# Altium project DATN.PrjPcb
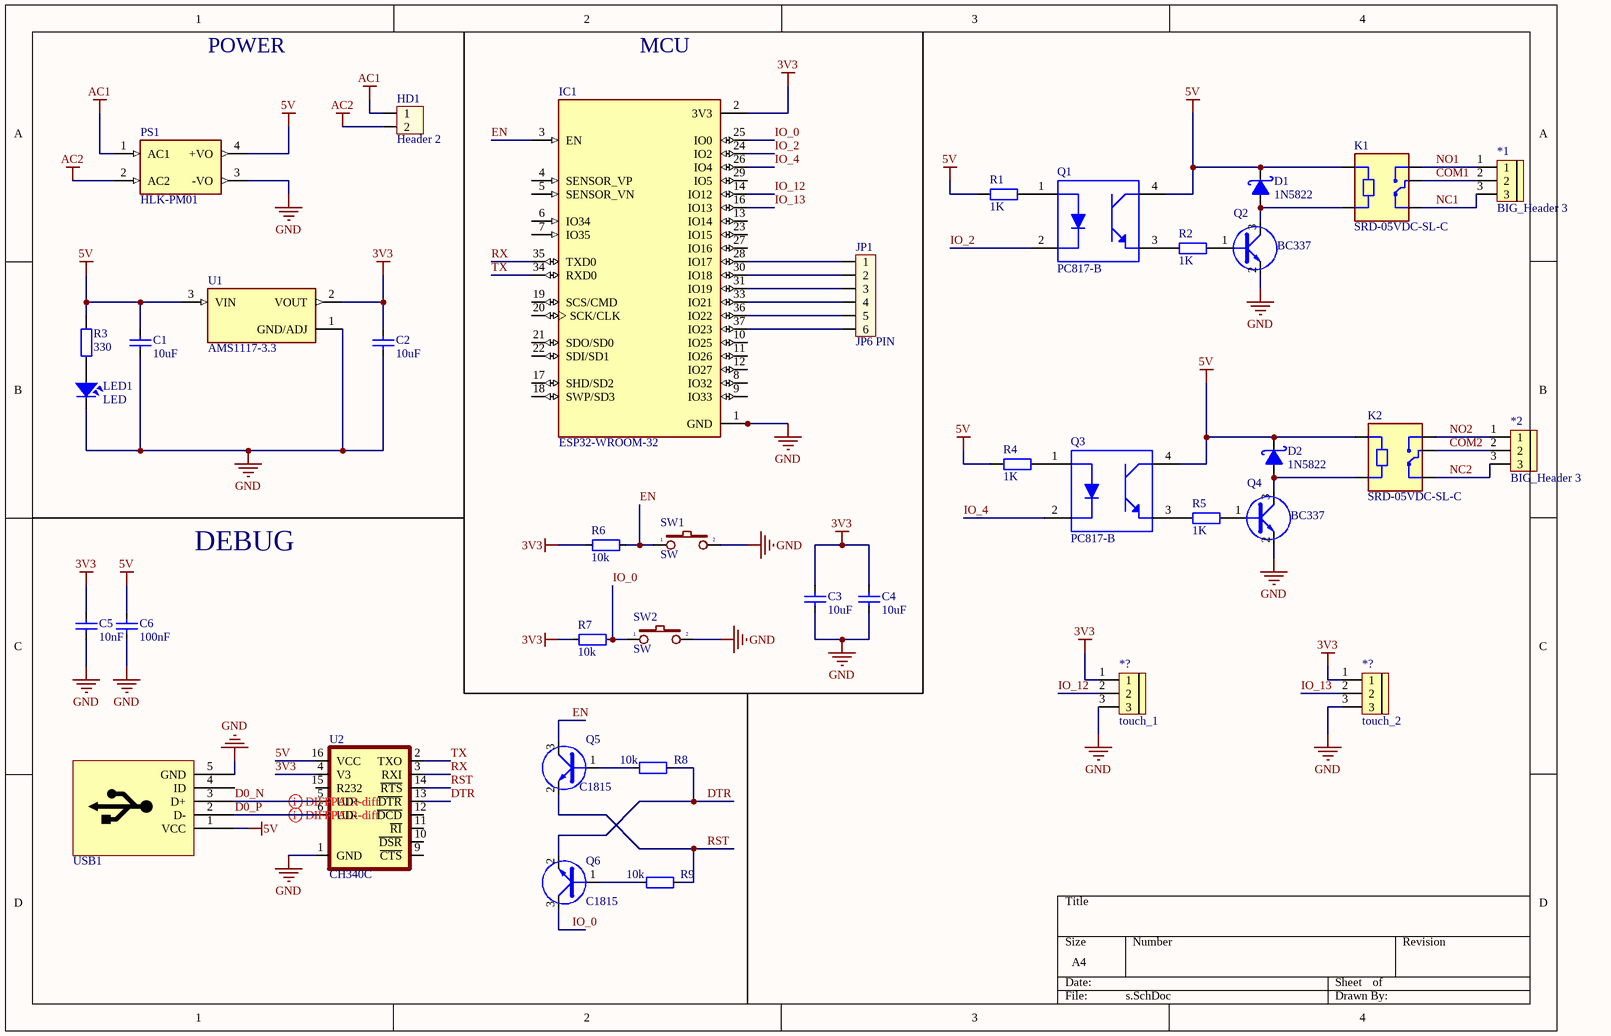
[diagram p0: s.SchDoc]
1 sheet, 39 parts. Net scope: global (net labels, ports and power ports of the same name join across sheets).
Board file: PCB1.PcbDoc

## Sheet s.SchDoc
size A4; SheetNumber: 1; SheetTotal: 1

### Parts
(Parts that share a designator on the sheet are numbered #1, #2 ... from top to bottom, then left to right.)
*1  BIG_Header 3  [BIG_Header 3]
*2  BIG_Header 3  [BIG_Header 3]
*?#1  touch_1  [BIG_Header 3]
*?#2  touch_2  [BIG_Header 3]
C1  10uF  [CAP_0805]
C2  10uF  [CAP_0805]
C3  10uF  [CAP_0805]
C4  10uF  [CAP_0402]
C5  10nF  [CAP_0805]
C6  100nF  [CAP_0805]
D1  1N5822  [SMA]
D2  1N5822  [SMA]
HD1  Header 2  [HED2]
IC1  ESP32-WROOM-32  [MODULE_ESP32-WROOM-32]
JP1  JP6 PIN  [JP6]
K1  SRD-05VDC-SL-C  [RELAY_SRD-05VDC-SL-C]
K2  SRD-05VDC-SL-C  [RELAY_SRD-05VDC-SL-C]
LED1  LED  [LED-0805-Blue]
PS1  HLK-PM01  [CONV_HLK-PM01]
Q1  PC817-B  [DIP762W50P254L650H455Q4B]
Q2  BC337  [TO-92]
Q3  PC817-B  [DIP762W50P254L650H455Q4B]
Q4  BC337  [TO-92]
Q5  C1815  [SOT23D]
Q6  C1815  [SOT23D]
R1  1K  [RES-SMD-0805]
R2  1K  [RES-SMD-0805]
R3  330  [RES-SMD-0805]
R4  1K  [RES-SMD-0805]
R5  1K  [RES-SMD-0805]
R6  10k  [RES-SMD-0805]
R7  10k  [RES-SMD-0805]
R8  10k  [RES-SMD-0805]
R9  10k  [RES-SMD-0805]
SW1  SW  [SW2]
SW2  SW  [SW2]
U1  AMS1117-3.3  [SOT229P700X180-4N]
U2  CH340C  [SOP-16]
USB1  USB  [USB-M1]  (value not drawn)

### Nets
3V3: *?#1.1 *?#2.1 C2.1 C3.1 C4.1 C5.1 IC1.2(3V3) R6.2 R7.2 U1.2(VOUT) U2.4(V3)
5V: C1.1 C6.1 D1.2(K) D2.2(K) K1.A1 K2.A1 PS1.4(+VO) Q1.4(COLLECTOR) Q3.4(COLLECTOR) R1.2 R3.2 R4.2 U1.3(VIN) U2.16(VCC) USB1.1(VCC)
AC1: HD1.1 PS1.1(AC1)
AC2: HD1.2 PS1.2(AC2)
GND: *?#1.3 *?#2.3 C1.2 C2.2 C3.2 C4.2 C5.2 C6.2 IC1.1(GND) IC1.15(GND) IC1.38(GND) IC1.39_1(GND) IC1.39_2(GND) IC1.39_3(GND) IC1.39_4(GND) IC1.39_5(GND) IC1.39_6(GND) IC1.39_7(GND) IC1.39_8(GND) IC1.39_9(GND) IC1.39_10(GND) IC1.39_11(GND) IC1.39_12(GND) IC1.39_13(GND) IC1.39_14(GND) IC1.39_15(GND) IC1.39_16(GND) IC1.39_17(GND) IC1.39_18(GND) IC1.39_19(GND) IC1.39_20(GND) IC1.39_21(GND) LED1.2 PS1.3(-VO) Q2.2(E) Q4.2(E) SW1.2 SW2.2 U1.1(GND/ADJ) U2.1(GND) USB1.5(GND)
COM1: *1.2 K1.COM
COM2: *2.2 K2.COM
D0_N: U2.5(UD+) USB1.3(D+)
D0_P: U2.6(UD-) USB1.2(D-)
DTR: Q6.2(E) R8.1 U2.13(~{DTR})
EN: IC1.3(EN) Q5.3(C) R6.1 SW1.1
IO_0: IC1.25(IO0) Q6.3(C) R7.1 SW2.1
IO_2: IC1.24(IO2) Q1.2(CATHODE)
IO_4: IC1.26(IO4) Q3.2(CATHODE)
IO_12: *?#1.2 IC1.14(IO12)
IO_13: *?#2.2 IC1.16(IO13)
NC1: *1.3 K1.NC
NC2: *2.3 K2.NC
NO1: *1.1 K1.NO
NO2: *2.1 K2.NO
RST: Q5.2(E) R9.1 U2.14(~{RTS})
RX: IC1.35(TXD0) U2.3(RXI)
TX: IC1.34(RXD0) U2.2(TXO)
NetD1_1: D1.1(A) K1.A2 Q2.3(C)
NetD2_1: D2.1(A) K2.A2 Q4.3(C)
NetIC1_28: IC1.28(IO17) JP1.1
NetIC1_30: IC1.30(IO18) JP1.2
NetIC1_31: IC1.31(IO19) JP1.3
NetIC1_33: IC1.33(IO21) JP1.4
NetIC1_36: IC1.36(IO22) JP1.5
NetIC1_37: IC1.37(IO23) JP1.6
NetLED1_1: LED1.1 R3.1
NetQ1_1: Q1.1(ANODE) R1.1
NetQ1_3: Q1.3(EMITTER) R2.2
NetQ2_1: Q2.1(B) R2.1
NetQ3_1: Q3.1(ANODE) R4.1
NetQ3_3: Q3.3(EMITTER) R5.2
NetQ4_1: Q4.1(B) R5.1
NetQ5_1: Q5.1(B) R8.2
NetQ6_1: Q6.1(B) R9.2

Not connected (* = marked no-connect by the designer): IC1 4(SENSOR_VP) 5(SENSOR_VN) 6(IO34) 7(IO35) 8(IO32) 9(IO33) 10(IO25) 11(IO26) 12(IO27) 13(IO14) 17(SHD/SD2) 18(SWP/SD3) 19(SCS/CMD) 20(SCK/CLK) 21(SDO/SD0) 22(SDI/SD1) 23(IO15) 27(IO16) 29(IO5); U2 9(~{CTS}) 10(~{DSR}) 11(~{RI}) 12(~{DCD}) 15(R232); USB1 4(ID)

### Layout directives
differential pair; differential pair class diff: D0_N, D0_P

### Notes on the sheet
- POWER
- MCU
- DEBUG

### Library data of the parts
*?#1 *?#2 = BIG_Header 3
C1-C6 = CapSMD: Capacitor; Value: 33p; Published: 8-Jun-2000; LatestRevisionDate: 17-Jul-2002; LatestRevisionNote: Re-released for DXP Platform.; PackageReference: RAD-0.3; Publisher: Altium Limited
D1 D2 = 1N5822: Schottky Rectifiers; Value: Diode c?m 1N5408
HD1 = Hed2: Header 2 (Green); Value: Header 2
IC1 = ESP32-WROOM-32: Bluetooth, WiFi Transceiver Module 2.4GHz ~ 2.5GHz Surface Mount; MF: Espressif Systems; Package: Module Espressif Systems; Digi-Key_Part_Number: 1904-1010-1-ND; Digi-Key_Purchase_URL: https://www.digikey.com/product-detail/en/espressif-systems/ESP32-WROOM-32/1904-1010-1-ND/8544305?utm_source=snapeda&utm_medium=aggregator&utm_campaign=symbol; Value: *; MP: ESP32-WROOM-32; SnapEDA_Link: https://www.snapeda.com/parts/ESP32-WROOM-32/Espressif%20Systems/view-part/2753322/?ref=snap
JP1 = JP6: Value: JP7
K1 K2 = SRD-05VDC-SL-C: 5V Trigger Relay Module For Arduino And Raspberry Pi 5V Trigger Relay Module For Arduino And Raspberry Pi; MF: Songle Relay; Check_prices: https://www.snapeda.com/parts/SRD-05VDC-SL-C/Songle+Relay/view-part/?ref=eda; Value: *; Availability: Not in stock; Price: None; Package: NON STANDARD-5 Songle Relay; MP: SRD-05VDC-SL-C; SnapEDA_Link: https://www.snapeda.com/parts/SRD-05VDC-SL-C/Songle+Relay/view-part/?ref=snap
LED1 = LED: LED Single colour Green and Red; Value: LED 3 ly Single Colour
PS1 = HLK-PM01: The HLK-PM01 is a small size low cost AC to DC converter which can take in 110V/220V AC at 50/60 Hz and give 5V 3W output. The module is can be used in designs which run on 5V and needs to be powered form the AC mains.; MF: Hi-link; Package: None; Price: None; Value: *; SnapEDA_Link: https://www.snapeda.com/parts/hlk-pm01/Hi-link/view-part/?ref=snap; MP: hlk-pm01; Availability: Not in stock; Check_prices: https://www.snapeda.com/parts/hlk-pm01/Hi-link/view-part/?ref=eda
Q1 Q3 = PC817-B: Phototransistors 4-DIP _0.300, 7.62mm_; MF: American Bright; SnapEDA_Link: https://www.snapeda.com/parts/PC817-B/American%20Bright/view-part/524587/?ref=snap; Availability: Unavailable; MP: PC817-B; Value: *; Price: None; Package: DIP-4 American Bright
Q2 Q4 = C1815: NPN 600mW, ECB; Value: C1815
Q5 Q6 = 2SC1815: NPN 600mW, ECB; Value: C1815
R1-R5 = Resistor - SMD: Resistor SMD; Manufacturer: Generic Components; Class: Passive; Published: 08/06/2000; Publisher: Altium Hobart Technology Centre
R6-R9 = Resistor - SMD: Resistor; Manufacturer: Generic Components; Class: Passive; Published: 08/06/2000; Publisher: Altium Hobart Technology Centre
SW1 SW2 = SW2: Switch button 2 pin; Value: SW chip 2 pin
U1 = AMS1117-3.3: Sot223/Pkg 1-Amp 3.3-Volt Low Drop Out Voltage Regulatator; MF: Advanced Monolithic Systems; Package: SOT-223 Seeed Technology; Value: *; Check_prices: https://www.snapeda.com/parts/AMS1117-3.3/Advanced+Monolithic+Systems/view-part/?ref=eda; Price: None; Availability: Not in stock; MP: AMS1117-3.3; SnapEDA_Link: https://www.snapeda.com/parts/AMS1117-3.3/Advanced+Monolithic+Systems/view-part/?ref=snap
U2 = CH340C: USB to serial chip CH340; MF: WCH; Package: Package; Check_prices: https://www.snapeda.com/parts/CH340C/WCH/view-part/5428851/?ref=eda; Value: *; Price: None; MP: CH340C; Availability: Unavailable; SnapEDA_Link: https://www.snapeda.com/parts/CH340C/WCH/view-part/5428851/?ref=snap
USB1 = USB-M